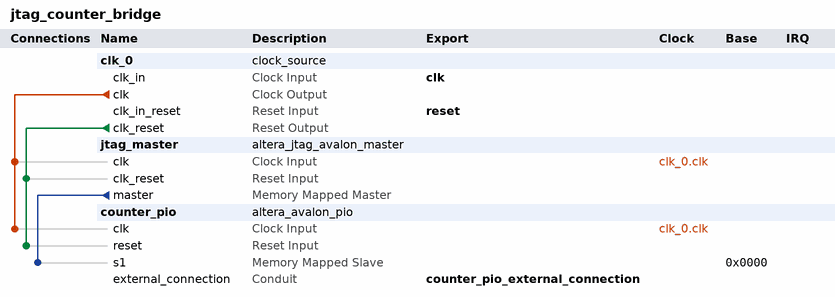
[diagram p0: system contents]
# Platform Designer (Qsys) system jtag_counter_bridge, Cyclone V 5CSEMA5F31C6
# Parameters at their usual value, and those the tool derives, are not listed.
package require -exact qsys 18.1
create_system jtag_counter_bridge
set_project_property DEVICE_FAMILY {Cyclone V}
set_project_property DEVICE 5CSEMA5F31C6

add_instance clk_0 clock_source 18.1
set_instance_parameter_value clk_0 clockFrequency 50000000
set_instance_parameter_value clk_0 resetSynchronousEdges DEASSERT

add_instance jtag_master altera_jtag_avalon_master 18.1

add_instance counter_pio altera_avalon_pio 18.1
set_instance_parameter_value counter_pio direction Input
set_instance_parameter_value counter_pio width 32

# connections
add_connection clk_0.clk counter_pio.clk clock
add_connection clk_0.clk jtag_master.clk clock
add_connection clk_0.clk_reset counter_pio.reset reset
add_connection clk_0.clk_reset jtag_master.clk_reset reset
add_connection jtag_master.master counter_pio.s1 avalon
set_connection_parameter_value jtag_master.master/counter_pio.s1 baseAddress 0x0000

# exported interfaces
add_interface clk clock sink
set_interface_property clk EXPORT_OF clk_0.clk_in
add_interface counter_pio_external_connection conduit end
set_interface_property counter_pio_external_connection EXPORT_OF counter_pio.external_connection
add_interface reset reset sink
set_interface_property reset EXPORT_OF clk_0.clk_in_reset

set_interconnect_requirement {$system} qsys_mm.clockCrossingAdapter AUTO
set_interconnect_requirement {$system} qsys_mm.enableEccProtection FALSE
set_interconnect_requirement {$system} qsys_mm.insertDefaultSlave FALSE
set_interconnect_requirement {$system} qsys_mm.maxAdditionalLatency 1

save_system jtag_counter_bridge.qsys
